# Altium schematic sheet LiPoBattery.SchDoc: LiPo Battery Charger (by Sparkfun)
size 431 x 279 mm; Author: Kirsch; CompanyName: HaSofu; DrawnBy: Kirsch; Engineer: Kirsch; Organization: HaSofu; DocumentNumber: 424242; Revision: A
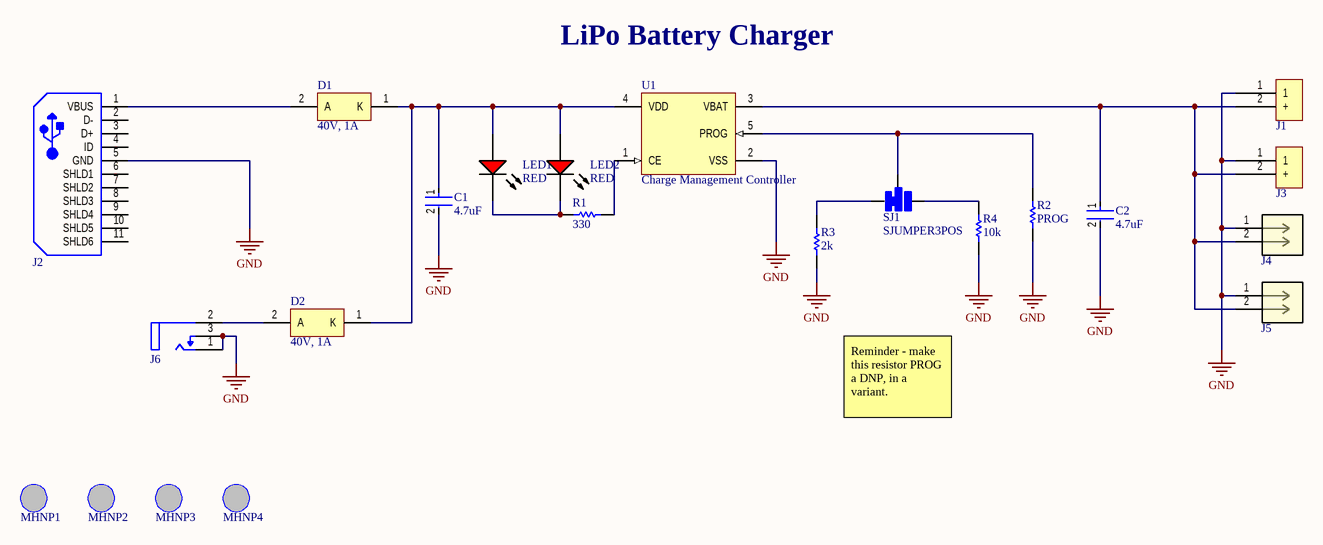
[diagram p0: LiPoBattery.SchDoc]

## Parts
C1  4.7uF  [FP-CC0805-0_85-MFG]
C2  4.7uF  [FP-CC0805-0_85-MFG]
D1  40V, 1A  [ONSC-SMA-2-403D-02_V]
D2  40V, 1A  [ONSC-SMA-2-403D-02_V]
J1  CONN HEADER R/A 2POS 5.08MM  [1-179276-2]  (value not drawn)
J2  47346-0001  [MOLX-47346-0001-5_V]  (value not drawn)
J3  CONN HEADER R/A 2POS 5.08MM  [1-179276-2]  (value not drawn)
J4  2 POS VERT HEADER 0.100"  [2Pins_AMP]  (value not drawn)
J5  2 POS VERT HEADER 0.100"  [2Pins_AMP]  (value not drawn)
J6  CONN PWR JACK 2.1X5.5MM SOLDER  [FP-RASM722PTR13X-MFG]  (value not drawn)
LED1  RED  [VISH-TLMS1000_V]
LED2  RED  [VISH-TLMS1000_V]
MHNP1  Mounting Hole Non-Plated 3.2mm  [MTHNP3P2MM]  (value not drawn)
MHNP2  Mounting Hole Non-Plated 3.2mm  [MTHNP3P2MM]  (value not drawn)
MHNP3  Mounting Hole Non-Plated 3.2mm  [MTHNP3P2MM]  (value not drawn)
MHNP4  Mounting Hole Non-Plated 3.2mm  [MTHNP3P2MM]  (value not drawn)
R1  330  [RESC2013X50X30NL20T20]
R2  PROG  [VISH-A1-2_V2]
R3  2k  [RESC2013X70X40ML20T20]
R4  10k  [RESC2013X70X40ML20T20]
SJ1  SJUMPER3POS  [SJUMPER3POS-Footprint-1]
U1  Charge Management Controller  [SOT-23-OT5_M]

## Nets
GND: C1.2 C2.2 J1.1 J2.5(GND) J3.1 J4.1 J5.1 J6.1(TIP_TERMINAL(CENTER_PIN)) J6.3(SHUNT_TERMINAL) R2.1 R3.2 R4.1 U1.2(VSS)
NetC1_1: C1.1 D1.1(K) D2.1(K) LED1.1(A) LED2.1(A) U1.4(VDD)
NetC2_1: C2.1 J1.2(+) J3.2(+) J4.2 J5.2 U1.3(VBAT)
NetD1_2: D1.2(A) J2.1(VBUS)
NetD2_2: D2.2(A) J6.2(SLEEVE_TERMINAL)
NetLED1_2: LED1.2(K) LED2.2(K) R1.1
NetR1_2: R1.2 U1.1(CE)
NetR2_2: R2.2 SJ1.2 U1.5(PROG)
NetR3_1: R3.1 SJ1.1
NetR4_2: R4.2 SJ1.3

Not connected (* = marked no-connect by the designer): J2 2(D-) 3(D+) 4(ID) 6(SHLD1) 7(SHLD2) 8(SHLD3) 9(SHLD4) 10(SHLD5) 11(SHLD6)

## Notes on the sheet
- LiPo Battery Charger
- Reminder - make this resistor PROG a DNP, in a variant.
- 8
- 7
- 6
- 5
- 4
- 3
- DWG. NO.
- REV.
- SHT.
- 2
- 1
- THIS DOCUMENT AND THE DATA DISCLOSED HEREIN OR HEREWITH IS THE PROPERTY OF ALTIUM LIMITED AND MAY BE FREELY DISTRIBUTED IN WHOLE. NO RIGHTS ARE RESERVED OR EXPRESS OR IMPLIED WARANTEE GIVEN.
- REVISION
- DESCRIPTION
- DATE
- APPROVED
- F
- E
- D
- C
- B
- ENG:
- APPROVALS
- PROJECT
- A
- DSN:
- CHK:
- REFERENCE DOCUMENTS
- PROJECT REVISION:
- TITLE
- DOCUMENT REVISION:
- DESIGN ITEM:
- BOM:
- FAB DWG:
- PCB DWG:
- ASSY DWG:
- SCALE:
- SIZE
- CAGE CODE
- FILE NAME
- DWG NO.
- SHEET
- OF
- REV

## Library data of the parts
C1 C2 = CAP CER 4.7UF 6.3V X7R 0805: 4.7µF ±10% 6.3V Ceramic Capacitor X7R 0805 (2012 Metric); Manufacturer: Yageo; Manufacturer Part Number: CC0805KKX7R5BB475; Tolerance: 0.1; Automotive: No; Temperature Characteristic: X7R; Package: CC0805-0.85; Value: 4.7 uF; Capacitance: 4.7 uF; Voltage Rating: 6.3 V; Octopart: https://octopart.com/cc0805kkx7r5bb475-yageo-27548069; Category: Cap; Digikey Description: CAP CER 4.7UF 6.3V X7R 0805; Device Class L3: Ceramic Capacitors; Temperature: -30°C to +85°C; ComponentLink2URL: http://www.yageo.com/documents/recent/UPY-GPHC_Y5V_6.3V-to-50V_8.pdf; Mouser Description: Multilayer Ceramic Capacitors MLCC - SMD/SMT 4.7uF 6.3V X7R 10%; Temperature Range High: +85°C; RoHS: TRUE; Device Class L2: Capacitors; ComponentLink2Description: Datasheet; Height: 0.95mm; Device Class L1: Passive Components; Ipc Land Pattern Name: CAPC200125X85; Material: Ceramic; Lead Free: Yes; Temperature Range Low: -30°C; Footprint Url: http://www.yageo.com/exep/pages/download/literatures/UPY-C_GEN_24.pdf; Supplier 1: Digi-Key; Supplier Part Number 1: 311-3419-1-ND
D1 D2 = DIODE SCHOTTKY 40V 1A SMA: Schottky Power Rectifier, 2-Pin SMA, Pb-Free, Cut Tape, Diode Schottky 40V 1A Surface Mount SMA; PartNumber: MBRA140T3G; Manufacturer: ON Semiconductor; Packing: Tape and Reel; Configuration: Single; IFSM Max (A): 30; PackageReference: SMA-2-403D-02; PackageDescription: 2-Pin Small Molded Package, J-Bend Lead, Body 2.605 x 4.315 mm; RoHS: TRUE; ComponentLink1Description: Manufacturer URL; ComponentLink3URL: http://www.onsemi.com/pub_link/Collateral/403D-02.PDF; ComponentLink2Description: Datasheet; ComponentLink2URL: http://www.onsemi.cn/pub_link/Collateral/MBRA140T3-D.PDF; DatasheetVersion: Rev. 10; ComponentLink1URL: http://www.onsemi.com/; ComponentLink3Description: Package Specification; Mounting Technology: Surface Mount; PackageVersion: Rev. G, 07/2012; Manufacturer Part Number: MBRA140T3G; Supplier 1: Digi-Key; Supplier Part Number 1: MBRA140T3GOSCT-ND
J1 J3 = CONN HEADER R/A 2POS 5.08MM: Connector Header Through Hole, Right Angle 2 position 0.200" (5.08mm); Manufacturer: TE Connectivity AMP Connectors; Manufacturer Part Number: 1-179276-2; ComponentLink1Description: Product URL; ComponentLink1URL: https://www.te.com/usa-en/product-1-179276-2.html?te_bu=Cor&te_type=other&te_campaign=oct_glo_manufacturer&elqCampaignId=26136; Supplier 1: Digi-Key; Supplier Part Number 1: A29545-ND
J2 = CONN RCPT USB2.0 MICRO B SMD R/A: Micro-USB B Receptacle with Flange, -30 to 85 degC, 5-Pin SMD, RoHS, Tape and Reel; Manufacturer: Molex; Number of Contacts: 5; Body Orientation: RightAngle; Maximum Voltage Rating: 30VAC; Pitch: 0.65mm; Maximum Current Rating: 1.8/ContactA; Number of Ports: 1; Gender: RCP; Operating Temperature: -30to85C; Color: Black; Termination Method: Solder; Contact Plating: GoldOverPalladiumNickelOverNickel; Dimension: 7.8x5.43x2.94mm; Number of Terminals: 5; Datasheet Version: Dec-13; Datasheet URL: https://datasheet.ciiva.com/30075/304740473460001-io-nectors-30075527.pdf; Contact Material: CopperAlloy; RoHS: Yes; Housing Material: LiquidCrystalPolymer; Manufacturer URL: http://www.molex.com/; Packaging: EmbossedTapeandReel; Mounting: SurfaceMount; Type: MicroUSBTypeB; Manufacturer Part Number: 47346-0001; Supplier 1: Digi-Key; Supplier Part Number 1: WM17141CT-ND
J4 J5 = CONN HEADER VERT 2POS 0.100": Connector Header Through Hole 2 position; Manufacturer Part Number: 67997-402HLF; Manufacturer: Amphenol ICC (FCI); Built_By: EMA_UL_Team; SourceLibrary: Amphenol_2013-08-06_Bergstik_2Row_67997; Copyright: Copyright (C) 2018 Accelerated Designs. All rights reserved; RefDes: RefDes; Supplier 1: Digi-Key; Supplier Part Number 1: 609-5502-ND
J6 = CONN PWR JACK 2.1X5.5MM SOLDER: Power Barrel Connector Jack 2.10mm ID (0.083"), 5.50mm OD (0.217") Surface Mount, Right Angle; Manufacturer: Switchcraft; Manufacturer Part Number: RASM722PTR13X; Shielding: Unshielded; Gender: Male; Current Rating: 5A; Termination: Solder; Contact Material: Copper Alloy; Package Quantity: 120; Case/Package: SMD/SMT; Contact Plating: Tin; Connector Type: Jack; Housing Material: Thermoplastic; Mount: Surface Mount; Housing Color: Black; Color: Black; Supplier 1: Digi-Key; Supplier Part Number 1: SC2028-1-ND
LED1 LED2 = LED RED 0603 SMD: Low Current LED, 40 mW, 1.8 V, -40 to 100 degC, 2-Pin SMD (0603), RoHS, Tape and Reel; Manufacturer: Vishay; Manufacturer Part Number: TLMS1000-GS08; Lens Shape: Rectangular; Automotive Qualification Standard: AEC-Q100; Wavelength Typ: 636nm; SVHC: ToBeAdvised; Bulb Size: 1.6mmx0.8mm; Forward Voltage: 1.8V; Luminous Intensity: 4mcd; Forward Current If: 2mA; Viewing Angle: 80°; Datasheet Version: Rev. 1.7, 02/2011; Datasheet URL: https://datasheet.ciiva.com/5798/1698881-5798337.pdf; LED Mounting: SMD; Packaging: CutTape; Package Reference: TLMS1000; Manufacturer URL: http://www.vishay.com/; Mounting Technology: SurfaceMount; Product Range: -; LED Colour: Red; Package Description: 2-Pin Surface Mount Device, Body 1.6 x 0.8 mm; MSL: MSL2-1year; Supplier 1: Digi-Key; Supplier Part Number 1: TLMS1000-GS08CT-ND
MHNP1-MHNP4 = MTHNP3P2MM: Mounting Hole Non-Plated 3.2 mm drill hole; Manufacturer: N/A; Manufacturer Part Number: N/A
R1 = RES SMD 330 OHM 1% 1/8W 0805: 330 Ohms ±1% 0.125W, 1/8W Chip Resistor 0805 (2012 Metric) Automotive AEC-Q200 Thick Film; Manufacturer: Vishay; Manufacturer Part Number: CRCW0805330RFKEA; Supplier 1: Digi-Key; Supplier Part Number 1: 541-330CCT-ND
R2 = RES 62K OHM 2W 5% AXIAL: Power Metal Film Leaded Resistor, 62 KOhm +/-5%, 2 W, 2-Pin THD, RoHS, Ammo Pack62 kOhms ±5% 2W Through Hole Resistor Axial Automotive AEC-Q200, Flame Retardant Coating, Safety Metal Film; PartNumber: PR02000206202JA100; Manufacturer: Vishay Semiconductor; Manufacturer Part Number: PR02000206202JR500; Resistance: 62 KOhm; Temperature Coefficient: +/-250 ppm/degC; ComponentLink2URL: http://www.vishay.com/docs/28729/28729.pdf; Mounting Technology: Through Hole; Tolerance: +/-5%; ComponentLink3Description: Package Specification; Power: 2 W; ComponentLink3URL: http://www.vishay.com/docs/28729/28729.pdf; ComponentLink1Description: Manufacturer URL; ComponentLink2Description: Datasheet; DatasheetVersion: Jun-13; PackageDescription: 2-Pin Axial Lead, Body 10 x 3.9 mm; ComponentLink1URL: http://www.vishay.com/; Packing: Ammo Pack; RoHS: TRUE; Supplier 1: Digi-Key; Supplier Part Number 1: PPC62KW-2CT-ND
R3 = RES SMD 2K OHM 5% 1/8W 0805: 2 kOhms ±5% 0.125W, 1/8W Chip Resistor 0805 (2012 Metric) Automotive AEC-Q200 Thick Film; Manufacturer: Panasonic; Manufacturer Part Number: ERJ-6GEYJ202V; Supplier 1: Digi-Key; Supplier Part Number 1: P2.0KACT-ND
R4 = RES SMD 10K OHM 1% 1/8W 0805: 10 kOhms ±1% 0.125W, 1/8W Chip Resistor 0805 (2012 Metric) Automotive AEC-Q200 Thick Film; Manufacturer: Panasonic; Manufacturer Part Number: ERJ-6ENF1002V; Supplier 1: Digi-Key; Supplier Part Number 1: P10.0KCCT-ND
SJ1 = SJUMPER3POS: Solder jumper 3 pads and pins; Pins: 3; Component Type: Miscellaneous; Manufacturer Part Number: N/A; Manufacturer: N/A
U1 = IC LI-ION/LI-POLY CTRLR SOT23-5: Simple, Miniature Single-Cell, Fully Integrated Li-Ion/Li-Polymer Charge Management Controller, 4.2V, 5-Pin SOT-23, Industrial Temperature, Cut Tape; Manufacturer: Microchip; Manufacturer Part Number: MCP73811T-420I/OT; Code_IPC: SOT23-5; PackageDescription: 5-Lead Plastic Small Outline Transistor (OT) [SOT-23]; PackageVersion: revBB, Aug-2009; DatasheetVersion: revB, Sep-2007; PackageReference: SOT-23-OT5; Supplier 1: Digi-Key; Supplier Part Number 1: MCP73811T-420I/OTCT-ND